# EAGLE design VEML6035 (EAGLE 9.4.1)
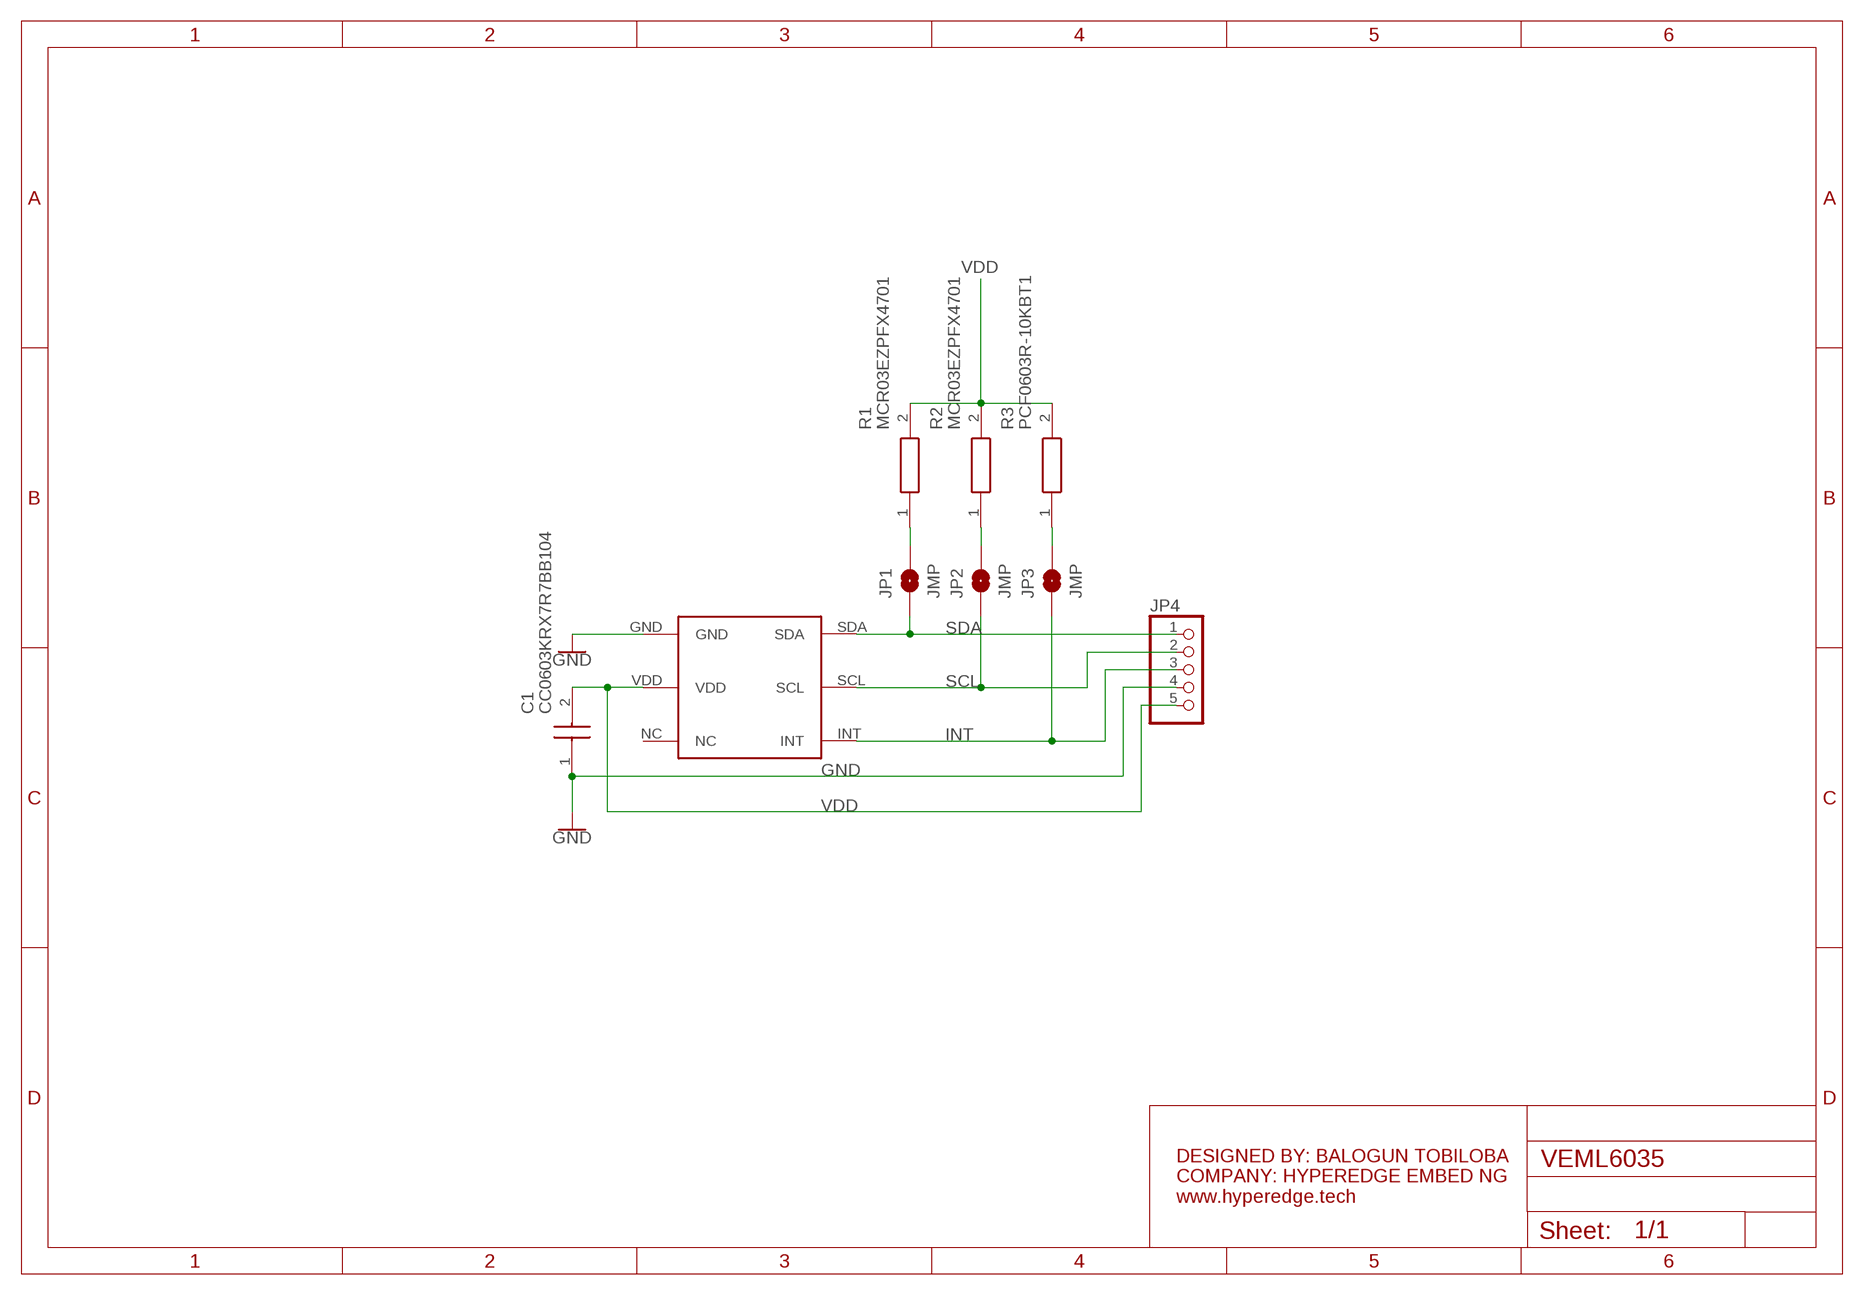
[diagram p0: schematic, sheet 1]

## Parts
C1  CC0603KRX7R7BB104  [CAPC1608X90N]
JP1  JMP  JUMPER-SMT_2_NO_NO-SILK  [SMT-JUMPER_2_NO_NO-SILK]
JP2  JMP  JUMPER-SMT_2_NO_NO-SILK  [SMT-JUMPER_2_NO_NO-SILK]
JP3  JMP  JUMPER-SMT_2_NO_NO-SILK  [SMT-JUMPER_2_NO_NO-SILK]
JP4  PINHD-1X5  [1X05]
R1  MCR03EZPFX4701  [RESC1608X55N]
R2  MCR03EZPFX4701  [RESC1608X55N]
R3  PCF0603R-10KBT1  [RESC1608X65N]
U$1  VEML6035  [VEML6035]

## Nets
GND: C1.1(C1) JP4.4 U$1.GND
INT: JP3.1 JP4.3 U$1.INT
N$1: JP1.2 R1.1
N$5: JP2.2 R2.1
N$6: JP3.2 R3.1
SCL: JP2.1 JP4.2 U$1.SCL
SDA: JP1.1 JP4.1 U$1.SDA
VDD: C1.2(C2) JP4.5 R1.2 R2.2 R3.2 U$1.VDD
Unconnected: U$1.NC

## Notes on the sheet
- DESIGNED BY: BALOGUN TOBILOBA
  COMPANY: HYPEREDGE EMBED NG
  www.hyperedge.tech

## Library data of the parts
C1 = VEML6035:CC0603KRX7R7BB104: CAPACITOR, 0603 100nF +/-10% 16V Source: Datasheet <http://componentsearchengine.com/Datasheets/1/CC0603KRX7R7BB104.pdf>; DESCRIPTION: CAPACITOR, 0603 100nF +/-10% 16V; HEIGHT: mm; MANUFACTURER_NAME: YAGEO (PHYCOMP); MANUFACTURER_PART_NUMBER: CC0603KRX7R7BB104; MOUSER_PART_NUMBER: 603-CC603KRX7R7BB104; MOUSER_PRICE-STOCK: https://www.mouser.com/Search/Refine.aspx?Keyword=603-CC603KRX7R7BB104; RS_PART_NUMBER: 6698763; RS_PRICE-STOCK: http://uk.rs-online.com/web/p/products/6698763
JP1-JP3 = VEML6035:JUMPER-SMT_2_NO: Normally open jumper This jumper has two pads in close proximity to each other. Apply solder to close the connection. Round pads are easier to solder for beginners, but are a lot larger. SparkFun Product that uses the round pads: SparkFun EL Sequencer <https://www.sparkfun.com/products/12781>
JP4 = VEML6035:PINHD-1X5: PIN HEADER
R1 R2 = VEML6035:MCR03EZPFX4701: ROHM MCR Series Thick Film Surface Mount Resistor 0603 Case 4.7k +/-1% 0.1W +/-100ppm/C Source: Datasheet <http://docs-emea.rs-online.com/webdocs/1471/0900766b814716e9.pdf>; DESCRIPTION: ROHM MCR Series Thick Film Surface Mount Resistor 0603 Case 4.7k +/-1% 0.1W +/-100ppm/C; HEIGHT: 0.55mm; MANUFACTURER_NAME: ROHM Semiconductor; MANUFACTURER_PART_NUMBER: MCR03EZPFX4701; RS_PART_NUMBER: 9013581; RS_PRICE-STOCK: https://uk.rs-online.com/web/p/products/9013581
R3 = VEML6035:PCF0603R-10KBT1: WELWYN - PCF0603R-10KBT1 - RES, 10K, 0.1%, 0.063W, 0603, THIN FILM Source: Datasheet <https://www.mouser.com/datasheet/2/414/PCF-1528243.pdf>; DESCRIPTION: WELWYN - PCF0603R-10KBT1 - RES, 10K, 0.1%, 0.063W, 0603, THIN FILM; HEIGHT: 0.65mm; MANUFACTURER_NAME: WELWYN; MANUFACTURER_PART_NUMBER: PCF0603R-10KBT1; MOUSER_PART_NUMBER: 756-PCF0603R-10KBT1; MOUSER_PRICE-STOCK: https://www.mouser.com/Search/Refine.aspx?Keyword=756-PCF0603R-10KBT1
U$1 = VEML6035:VEML6035: VEML6035 The VEML6035 library was created by www.hyperedge.tech

## Net classes
0 default: width 0.254 mm, clearance 0.152 mm

## Board
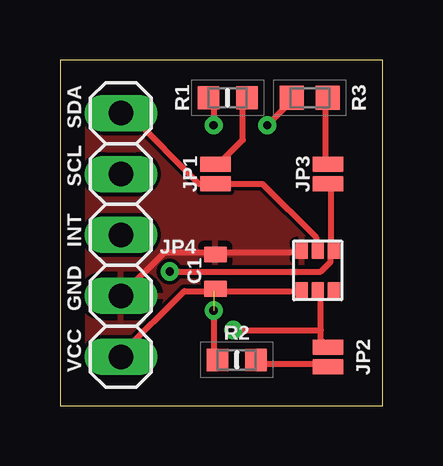
[diagram p1: board, top side]
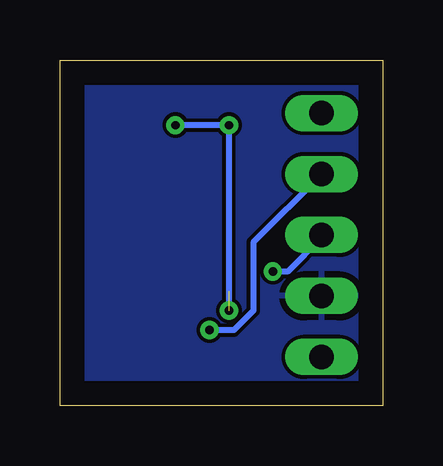
[diagram p2: board, bottom side, seen from below]

Size 13.44 x 14.4 mm. Coordinates in mm from the lower left corner, seen from the top.
Outline: 0,0 13.44,0 13.44,14.4 0,14.4 0,0
Copper layers (1*16): Top 0.035mm / dielectric 1.5mm / Bottom 0.035mm
Design rules "default": minimum track width 6mil, minimum drill 0.35mm, track to track 6mil, track to pad 6mil, pad to pad 6mil, via to via 6mil, smd to smd 6mil, copper to edge 40mil, drill to drill 6mil, minimum pad ring 10mil, minimum via ring 8mil, stop-mask expansion 4mil, vias tented up to drill 0mil, thermal gap 10mil

### Footprints (pad centres in the part's own frame; a part is rotated, then mirrored left to right if it is on the bottom)
CAPC1608X90N = smd 0.66 x 0.94: 1 -0.711,0; 2 0.711,0
SMT-JUMPER_2_NO_NO-SILK = smd 0.635 x 1.27: 1 -0.406,0; 2 0.406,0
1X05 = drill 1.016 long: 1 -5.08,0; 2 -2.54,0; 3 0,0; 4 2.54,0; 5 5.08,0
RESC1608X55N = smd 0.9 x 0.95: 1 -0.8,0; 2 0.8,0
RESC1608X65N = smd 1 x 1: 1 -0.75,0; 2 0.75,0
VEML6035 = smd 0.65 x 0.5: GND -8.28,0.73; INT -8.28,-0.61; NC -9.92,-0.61; SCL -9.92,0.06; SDA -8.28,0.06; VDD -9.92,0.73

### Placement (x,y rotation side)
C1  6.48,5.59 270 top
JP1  6.48,9.65 90 top
JP2  11.18,2.03 270 top
JP3  11.18,9.65 90 top
JP4  2.54,7.11 270 top
R1  6.98,12.83 180 top
R2  7.37,1.9 180 top
R3  10.41,12.83 180 top
U$1  10.8,14.73 90 top

### Tracks (layer width: path | path; a pad name or v marks a point on that pad's centre or on a via)
GND
  Top 0.254: U$1.GND 10.06,6.4 6.6,6.4 C1.1 6.4,6.4 4.37,6.4 JP4.4
  pour Top: 0,14.4 0,0 13.44,0 13.44,14.4
  pour Bottom: 0,14.4 0,0 13.44,0 13.44,14.4
INT  (via drill 0.35)
  Top 0.254: JP3.1 11.28,9.25 11.28,6.6 U$1.INT 11.28,6.4 11.28,5.99 10.87,5.59 v4.57,5.59
  Bottom 0.254: v4.57,5.59 3.96,5.59 2.54,7.01 JP4.3
N$1
  Top 0.254: R1.1 7.62,12.7 7.62,11.07 6.6,10.06 JP1.2
N$5
  Top 0.254: R2.1 8.23,1.73 11.07,1.73 JP2.2
N$6
  Top 0.254: R3.1 11.07,12.7 11.07,10.06 JP3.2
SCL  (via drill 0.35)
  Top 0.254: 10.87,3.15 10.87,2.74 JP2.1 | 10.87,3.15 10.87,4.77 U$1.SCL | v7.21,3.15 10.87,3.15
  Bottom 0.254: v7.21,3.15 6.2,3.15 5.39,3.96 5.39,6.81 JP4.2
SDA
  Top 0.254: U$1.SDA 10.67,6.6 10.67,7.01 8.43,9.25 JP1.1 5.79,9.25 2.95,12.09 2.54,12.09 JP4.1
VDD  (via drill 0.35)  (1 unrouted)
  Top 0.254: v6.4,3.96 6.4,1.93 R2.2 | v6.4,11.68 6.4,12.5 6.2,12.7 R1.2 | v8.64,11.68 9.65,12.7 R3.2 | U$1.VDD 10.06,4.77 6.6,4.77 C1.2 6.4,4.77 5.18,4.77 2.54,2.13 JP4.5
  Bottom 0.254: v6.4,3.96 v6.4,11.68 v8.64,11.68

### Text on the board
tNames: SDA | SCL | INT | GND | VCC